# Altium schematic sheet RFID.SchDoc
size A4; SheetNumber: 1; SheetTotal: 3
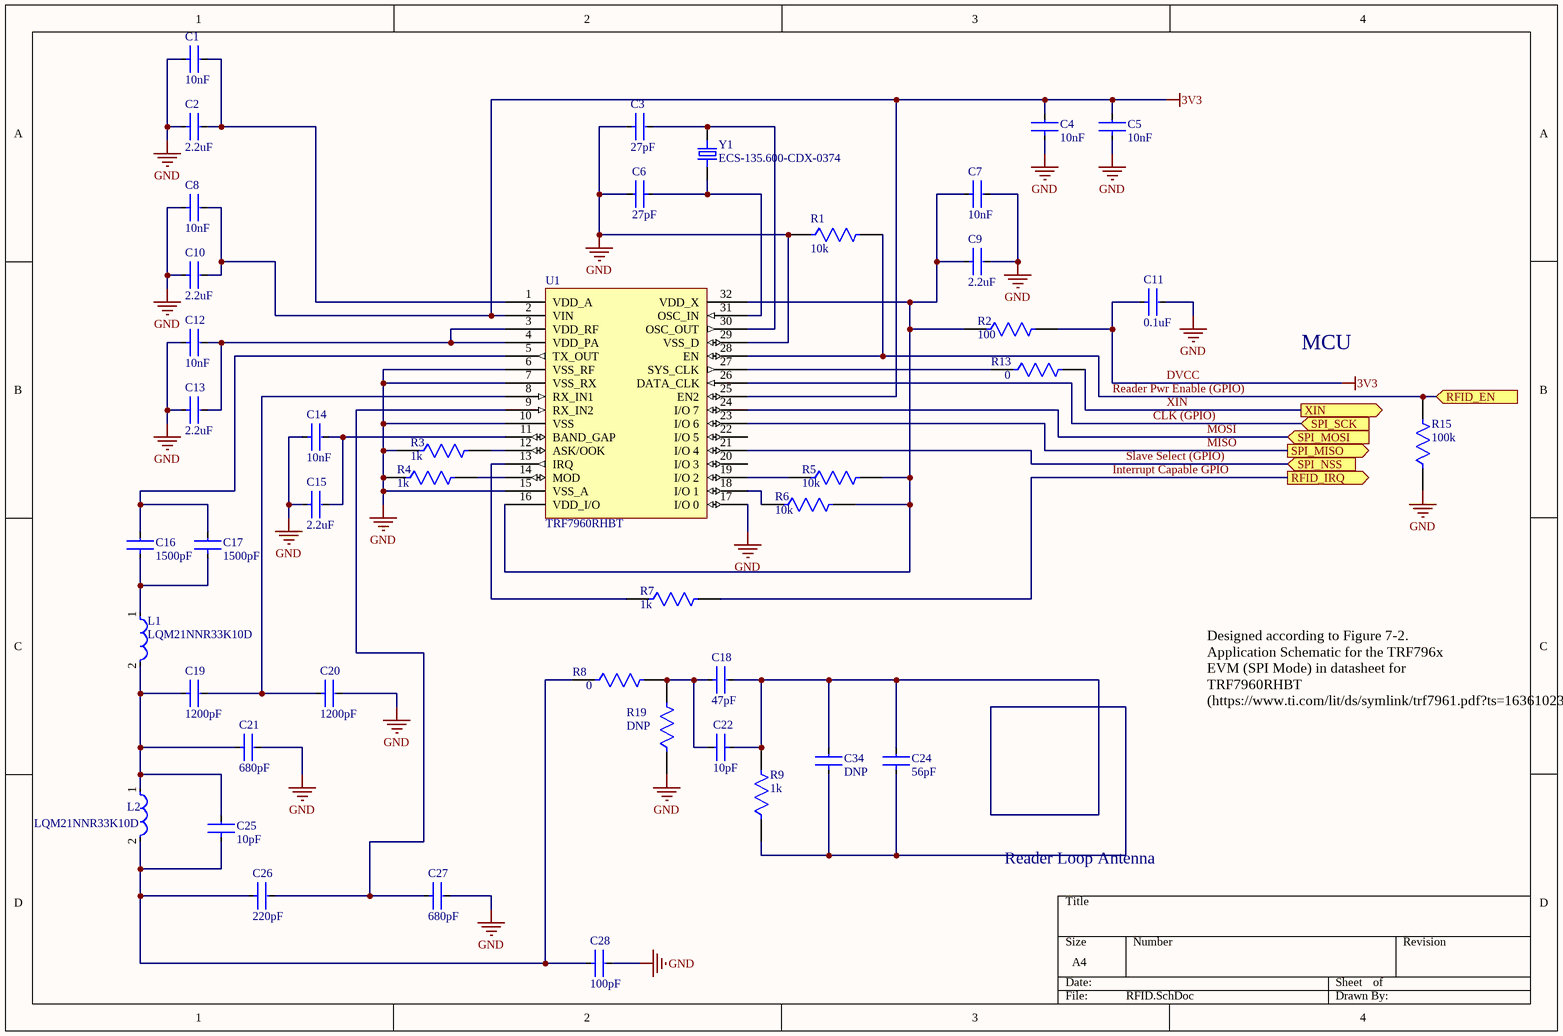
[diagram p0: RFID.SchDoc]

## Parts
C1  10nF  [FP-GCJ21B-0_3-IPC_A]
C2  2.2uF  [FP-GCJ21B-0_3-IPC_A]
C3  27pF  [FP-GCJ21B-0_3-IPC_A]
C4  10nF  [FP-GCJ21B-0_3-IPC_A]
C5  10nF  [FP-GCJ21B-0_3-IPC_A]
C6  27pF  [FP-GCJ21B-0_3-IPC_A]
C7  10nF  [FP-GCJ21B-0_3-IPC_A]
C8  10nF  [FP-GCJ21B-0_3-IPC_A]
C9  2.2uF  [FP-GCJ21B-0_3-IPC_A]
C10  2.2uF  [FP-GCJ21B-0_3-IPC_A]
C11  0.1uF  [FP-GCJ21B-0_3-IPC_A]
C12  10nF  [FP-GCJ21B-0_3-IPC_A]
C13  2.2uF  [FP-GCJ21B-0_3-IPC_A]
C14  10nF  [FP-GCJ21B-0_3-IPC_A]
C15  2.2uF  [FP-GCJ21B-0_3-IPC_A]
C16  1500pF  [FP-GCJ21B-0_3-IPC_A]
C17  1500pF  [FP-GCJ21B-0_3-IPC_A]
C18  47pF  [FP-GCJ21B-0_3-IPC_A]
C19  1200pF  [FP-GCJ21B-0_3-IPC_A]
C20  1200pF  [FP-GCJ21B-0_3-IPC_A]
C21  680pF  [FP-GCJ21B-0_3-IPC_A]
C22  10pF  [FP-GCJ21B-0_3-IPC_A]
C24  56pF  [FP-GCJ21B-0_3-IPC_A]
C25  10pF  [FP-GCJ21B-0_3-IPC_A]
C26  220pF  [FP-GCJ21B-0_3-IPC_A]
C27  680pF  [FP-GCJ21B-0_3-IPC_A]
C28  100pF  [FP-GCJ21B-0_3-IPC_A]
C34  DNP  [FP-GCJ21B-0_3-IPC_A]
L1  LQM21NNR33K10D  [FP-LQM21DN_00-IPC_A]
L2  LQM21NNR33K10D  [FP-LQM21DN_00-IPC_A]
R1  10k  [FP-AC0603-MFG]
R2  100  [FP-AC0603-MFG]
R3  1k  [FP-AC0603-MFG]
R4  1k  [FP-AC0603-MFG]
R5  10k  [FP-AC0603-MFG]
R6  10k  [FP-AC0603-MFG]
R7  1k  [FP-AC0603-MFG]
R8  0  [FP-AC0603-MFG]
R9  1k  [FP-AC0603-MFG]
R13  0  [FP-AC0603-MFG]
R15  100k  [FP-AC0603-MFG]
R19  DNP  [FP-AC0603-MFG]
U1  TRF7960RHBT  [IC_ADS125H01IRHBT]
Y1  ECS-135.600-CDX-0374  [XTAL_ECS-135.600-CDX-0374]

## Ports
RFID_EN (in), RFID_IRQ (out), SPI_MISO (out), SPI_MOSI (in), SPI_NSS (in), SPI_SCK (in), XIN (out)

## Nets
DVCC: C4.2 C5.2 C8.2 C10.2 C11.1 R2.2 U1.2(VIN) U1.25(EN2)  [also labelled 3V3]
GND: C1.1 C2.1 C3.1 C4.1 C5.1 C6.2 C7.2 C8.1 C9.2 C10.1 C11.2 C12.1 C13.1 C14.1 C15.1 C20.2 C21.2 C27.2 C28.2 R1.1 R3.1 R4.1 R15.1 R19.1 U1.6(VSS_RF) U1.7(VSS_RX) U1.10(VSS) U1.15(VSS_A) U1.17(I/O_0) U1.29(VSS_D)
CLK (GPIO): U1.26(DATA_CLK) ; port SPI_SCK
Interrupt Capable GPIO: R7.2 ; port RFID_IRQ
MISO: U1.23(I/O_6) ; port SPI_MISO
MOSI: U1.24(I/O_7) ; port SPI_MOSI
Reader Pwr Enable (GPIO): R1.2 R15.2 U1.28(EN) ; port RFID_EN
Slave Select (GPIO): U1.21(I/O_4) ; port SPI_NSS
XIN: R13.2 ; port XIN
NetC1_2: C1.2 C2.2 U1.1(VDD_A)
NetC3_2: C3.2 U1.30(OSC_OUT) Y1.2
NetC6_1: C6.1 U1.31(OSC_IN) Y1.1
NetC7_1: C7.1 C9.1 R2.1 R5.2 R6.2 U1.16(VDD_I/O) U1.32(VDD_X)
NetC12_2: C12.2 C13.2 U1.3(VDD_RF) U1.4(VDD_PA)
NetC14_2: C14.2 C15.2 U1.11(BAND_GAP)
NetC16_1: C16.1 C17.1 L1.1
NetC16_2: C16.2 C17.2 U1.5(TX_OUT)
NetC18_1: C18.1 C22.2 R8.2 R19.2
NetC18_2: C18.2 C22.1 C24.1 C24.2 C34.1 C34.2 R9.1 R9.2
NetC19_1: C19.1 C21.1 C25.2 L1.2 L2.1
NetC19_2: C19.2 C20.1 U1.8(RX_IN1)
NetC25_1: C25.1 C26.1 C28.1 L2.2 R8.1
NetC26_2: C26.2 C27.1 U1.9(RX_IN2)
NetR3_2: R3.2 U1.12(ASK/OOK)
NetR4_2: R4.2 U1.14(MOD)
NetR5_1: R5.1 U1.19(I/O_2)
NetR6_1: R6.1 U1.18(I/O_1)
NetR7_1: R7.1 U1.13(IRQ)
NetR13_1: R13.1 U1.27(SYS_CLK)

Not connected (* = marked no-connect by the designer): U1 20(I/O_3) 22(I/O_5)

## Notes on the sheet
- MCU
- Designed according to Figure 7-2. Application Schematic for the TRF796x EVM (SPI Mode) in datasheet for TRF7960RHBT               (https://www.ti.com/lit/ds/symlink/trf7961.pdf?ts=1636102370290&ref_url=https%253A%252F%252Fwww.google.com%252F)
- Reader Loop Antenna

## Library data of the parts
C1-C22 C24-C28 C34 = CMP-2007-03210-2: Multilayer Ceramic Capacitors MLCC - SMD/SMT 0805 2.2uF 10%, 16VDC,  X7R 15%; Voltage Rating (DC): 16V; Thickness: 0.057inch; Lead Free: Lead Free; Dielectric: X7R; Case Code (Imperial): 0805; Packaging: Tape and Reel; Features: Soft Termination; Termination: SMD/SMT; Height: 1.25mm; Radiation Hardening: No; Capacitance: 2.2uF; Package Quantity: 1; Min Operating Temperature: -55°C; Ratings: AEC-Q200; Voltage Rating: 16V; Case/Package: 0805; Max Operating Temperature: 125°C; Depth: 1.25mm; Tolerance: 10%; Case Code (Metric): 2012; Length: 2mm; Mount: Surface Mount; Width: 0.049inch
L1 L2 = CMP-06042-017039-1: Multilayer Type Inductor for General Circuits, 0805 (2012), 0.33μH, 10%, 0.48Ω, 250mA; DC Resistance (DCR): 480mR; Self Resonant Frequency: 180MHz; Q Factor: 20; Core Material: Ferrite; Inductance: 330nH; Shielding: Shielded; Test Frequency: 25MHz; Max DC Current: 250mA; Number of Pins: 2; Mount: Surface Mount; Case/Package: 0805; Case Code (Metric): 2012; Min Operating Temperature: -40°C; Package Quantity: 4000; DC Current: 250mA; Max Operating Temperature: 85°C; Height - Seated (Max): 0.041inch; REACH SVHC: No SVHC; Radiation Hardening: No; Current Rating: 250mA; Length: 2mm; Depth: 1.45mm; Height: 0.85mm; Packaging: Tape and Reel; Inductance Tolerance: 10%; Case Code (Imperial): 0805; Series: LQM21N; Military Standard: Not; Width: 0.049inch; RoHS Compliant: Yes; Termination: SMD/SMT; Tolerance: 10%
R1-R9 R13 R15 R19 = CMP-03412-025180-1: RES SMD 60.4 OHM 1% 1/10W 0603; Manufacturer Part Number: AC0603FR-0760R4L; Manufacturer: Yageo; Automotive Grade: Grade 0; Value: 60.4Ω; Power Rating: 0.1W; Voltage Rating: 75V; Tolerance: 0.01; Automotive: Yes; Category: Res; Mouser Description: Res Thick Film 0603 60.4 Ohm 1% 0.1W(1/10W) ±100ppm/C Epoxy Pad SMD Automotive T/R; Height: 0.55mm; Temperature: -55°C to +155°C; Resistance: 60.4Ω; Package: AC0603; Device Class L3: Chip SMD Resistors; ComponentLink2URL: http://www.yageo.com/NewPortal/yageodocoutput?fileName=/pdf/R-Chip/PYu-AC_51_RoHS_L_6.pdf; Composition: Thick Film; Octopart: https://octopart.com/ac0603fr-0760r4l-yageo-71367350; Temperature Range Low: -55°C; Lead Free: Yes; Footprint Url: http://www.yageo.com/exep/pages/download/literatures/PYu-R_Mount_9.pdf; ComponentLink2Description: Datasheet; Series: AC; Device Class L1: Passive Components; Device Class L2: Resistors; Temperature Range High: +155°C; RoHS: TRUE; Digikey Description: RES SMD 60.4 OHM 1% 1/10W 0603; Ipc Land Pattern Name: RESC16080X45
U1 = TRF7960RHBT: TRF7960 Multi-Protocol Fully Integrated 13.56-MHz RFID Reader/Writer IC 32-VQFN -40 to 110
Y1 = ECS-135.600-CDX-0374: Package: None; Price: None; Value: *; MP: ECS-135.600-CDX-0374; Availability: Unavailable